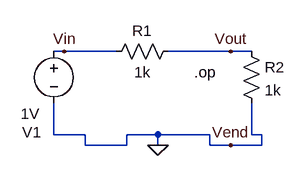
[diagram p0: schematic Scematic02.asc]
Scematic02.asc, the LTspice schematic file:
Version 4
SHEET 1 880 680
WIRE -96 112 -112 112
WIRE -16 112 -96 112
WIRE 160 112 64 112
WIRE 192 112 160 112
WIRE -112 240 -112 192
WIRE -64 240 -112 240
WIRE 48 240 0 240
WIRE 128 240 48 240
WIRE 192 240 192 192
WIRE 208 240 192 240
WIRE -64 256 -64 240
WIRE 0 256 0 240
WIRE 0 256 -64 256
WIRE 48 256 48 240
WIRE 128 256 128 240
WIRE 160 256 128 256
WIRE 208 256 208 240
WIRE 208 256 160 256
FLAG 48 256 0
FLAG 160 112 Vout
FLAG -96 112 Vin
FLAG 160 256 Vend
SYMBOL res 80 96 R90
WINDOW 0 0 56 VBottom 2
WINDOW 3 32 56 VTop 2
SYMATTR InstName R1
SYMATTR Value 1k
SYMBOL res 176 96 R0
SYMATTR InstName R2
SYMATTR Value 1k
SYMBOL voltage -112 96 R0
WINDOW 0 -49 140 Left 2
WINDOW 3 -51 112 Left 2
WINDOW 123 0 0 Left 2
WINDOW 39 0 0 Left 2
SYMATTR InstName V1
SYMATTR Value 1V
TEXT 104 144 Left 2 !.op

The netlist it stands for:
* Scematic02.asc
R1 Vout Vin 1k
R2 Vout 0 1k
V1 Vin 0 1V
.op
.backanno
.end